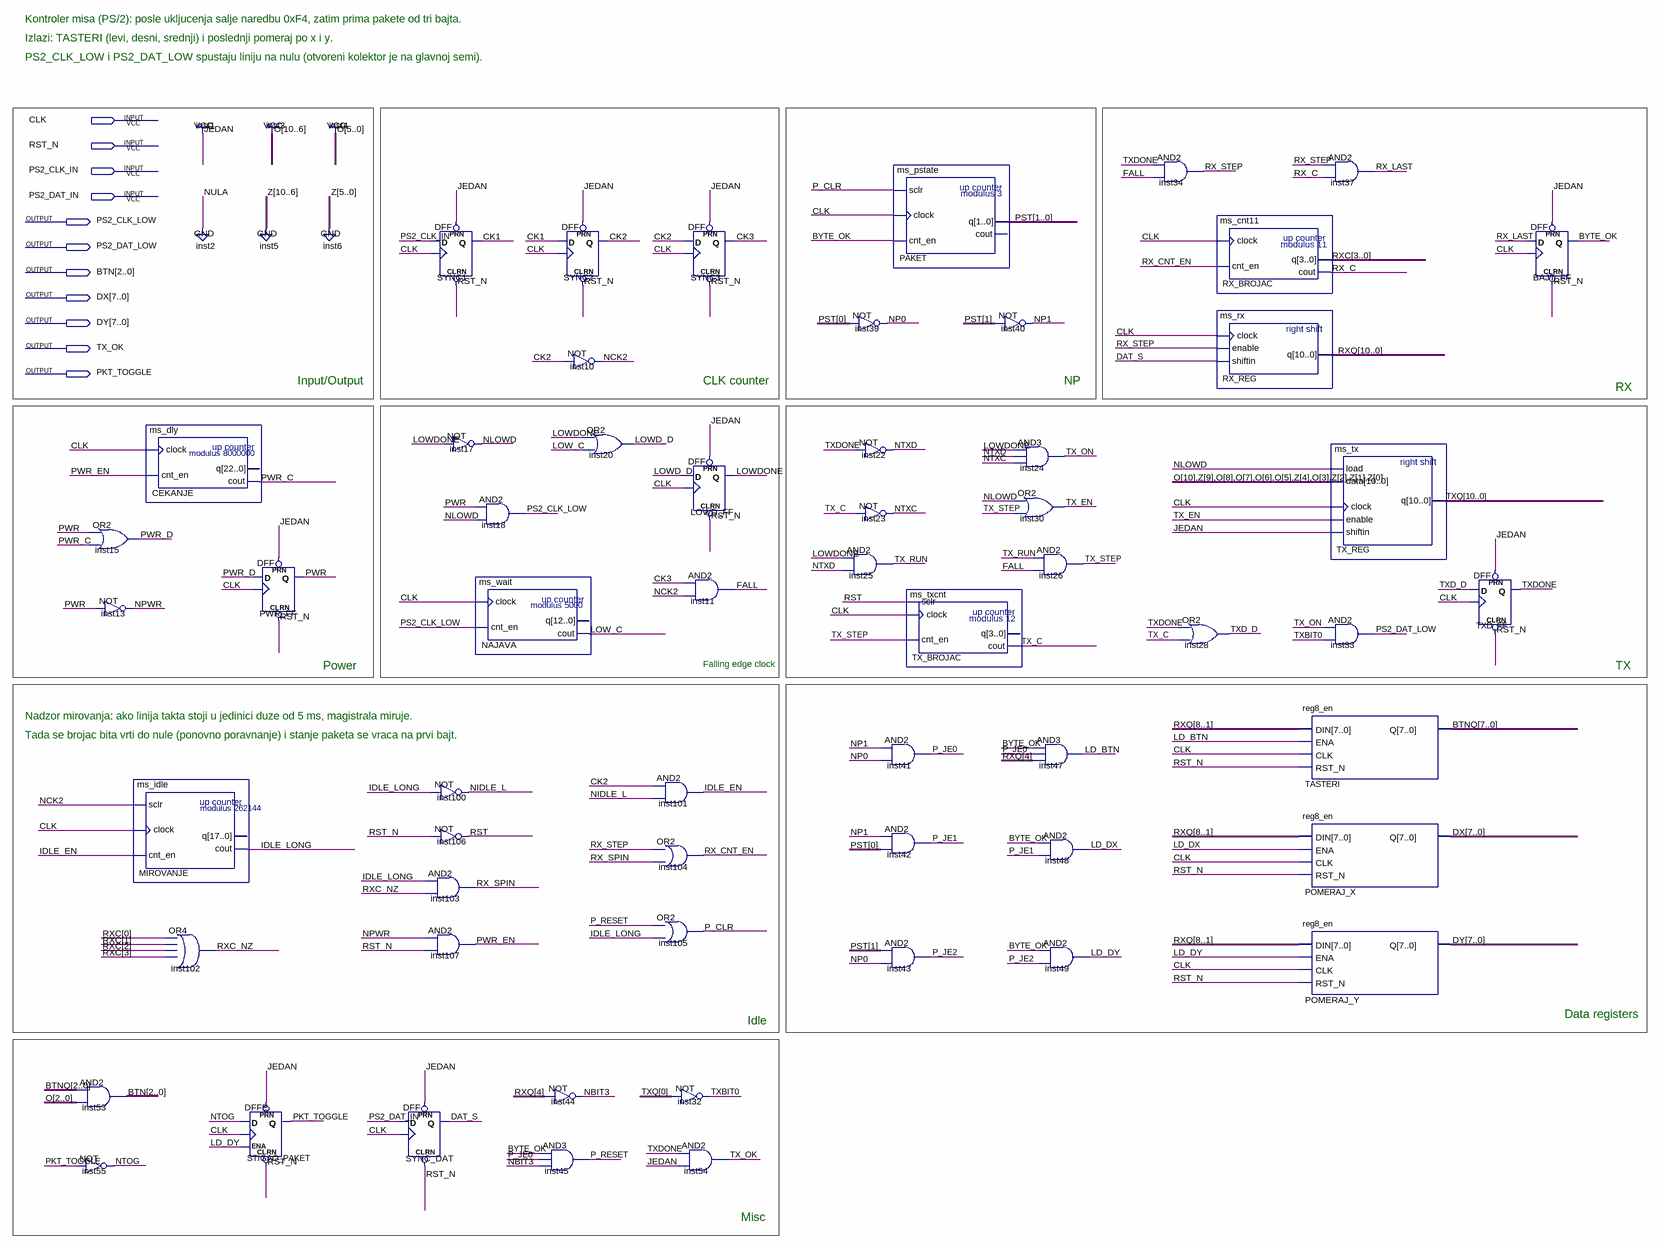
[diagram p0: schematic sheet]
// Quartus schematic mouse_ps2.bdf as structural Verilog: 59 symbols, 11 pins
module mouse_ps2 (
  input  CLK,
  input  RST_N,
  input  PS2_CLK_IN,
  input  PS2_DAT_IN,
  output PS2_CLK_LOW,
  output PS2_DAT_LOW,
  output [2:0] BTN,
  output [7:0] DX,
  output [7:0] DY,
  output TX_OK,
  output PKT_TOGGLE
);

  wire BYTE_OK, CK1, CK2, CK3, DAT_S, FALL, IDLE_EN, IDLE_LONG, LD_BTN, LD_DX, LD_DY, LOW_C, LOWD_D, LOWDONE,
       NBIT3, NCK2, NIDLE_L, NLOWD, NP0, NP1, NPWR, NTOG, NTXC, NTXD, P_CLR, P_JE0, P_JE1, P_JE2, P_RESET,
       PWR, PWR_C, PWR_D, PWR_EN, RST, RX_C, RX_CNT_EN, RX_LAST, RX_SPIN, RX_STEP, RXC_NZ, TX_C, TX_EN,
       TX_ON, TX_RUN, TX_STEP, TXBIT0, TXD_D, TXDONE;
  wire [1:0] PST;
  wire [3:0] RXC;
  wire [7:0] BTNQ;
  wire [10:0] RXQ, TXQ;

  or inst15 (PWR_D, PWR, PWR_C);
  not inst13 (NPWR, PWR);
  assign BTN = BTNQ[2:0] & 3'b111;  // AND2 inst53, 3 bits wide
  not inst55 (NTOG, PKT_TOGGLE);
  ms_dly CEKANJE (.clock(CLK), .cnt_en(PWR_EN), .cout(PWR_C));  // open: q
  ms_idle MIROVANJE (.sclr(NCK2), .clock(CLK), .cnt_en(IDLE_EN), .cout(IDLE_LONG));  // open: q
  or inst102 (RXC_NZ, RXC[0], RXC[1], RXC[2], RXC[3]);
  DFF PWR_FF (.CLRN(RST_N), .CLK(CLK), .D(PWR_D), .PRN(1'b1), .Q(PWR));
  DFFE STIGAO_PAKET (.PRN(1'b1), .CLRN(RST_N), .D(NTOG), .CLK(CLK), .ENA(LD_DY), .Q(PKT_TOGGLE));
  and inst103 (RX_SPIN, IDLE_LONG, RXC_NZ);
  and inst107 (PWR_EN, NPWR, RST_N);
  DFF SYNC_DAT (.CLRN(RST_N), .CLK(CLK), .D(PS2_DAT_IN), .PRN(1'b1), .Q(DAT_S));
  DFF SYNC1 (.CLRN(RST_N), .CLK(CLK), .D(PS2_CLK_IN), .PRN(1'b1), .Q(CK1));
  not inst17 (NLOWD, LOWDONE);
  and inst18 (PS2_CLK_LOW, PWR, NLOWD);
  ms_wait NAJAVA (.clock(CLK), .cnt_en(PS2_CLK_LOW), .cout(LOW_C));  // open: q
  not inst100 (NIDLE_L, IDLE_LONG);
  not inst106 (RST, RST_N);
  DFF SYNC2 (.CLRN(RST_N), .CLK(CLK), .D(CK1), .PRN(1'b1), .Q(CK2));
  not inst10 (NCK2, CK2);
  not inst44 (NBIT3, RXQ[4]);
  and inst45 (P_RESET, BYTE_OK, P_JE0, NBIT3);
  or inst20 (LOWD_D, LOWDONE, LOW_C);
  and inst101 (IDLE_EN, CK2, NIDLE_L);
  or inst104 (RX_CNT_EN, RX_STEP, RX_SPIN);
  or inst105 (P_CLR, P_RESET, IDLE_LONG);
  not inst32 (TXBIT0, TXQ[0]);
  and inst54 (TX_OK, TXDONE, 1'b1);
  DFF SYNC3 (.CLRN(RST_N), .CLK(CLK), .D(CK2), .PRN(1'b1), .Q(CK3));
  DFF LOWD_FF (.CLRN(RST_N), .CLK(CLK), .D(LOWD_D), .PRN(1'b1), .Q(LOWDONE));
  and inst11 (FALL, CK3, NCK2);
  not inst39 (NP0, PST[0]);
  not inst22 (NTXD, TXDONE);
  not inst23 (NTXC, TX_C);
  and inst25 (TX_RUN, LOWDONE, NTXD);
  and inst41 (P_JE0, NP1, NP0);
  and inst42 (P_JE1, NP1, PST[0]);
  and inst43 (P_JE2, PST[1], NP0);
  ms_pstate PAKET (.sclr(P_CLR), .clock(CLK), .cnt_en(BYTE_OK), .q(PST));  // open: cout
  ms_txcnt TX_BROJAC (.sclr(RST), .clock(CLK), .cnt_en(TX_STEP), .cout(TX_C));  // open: q
  not inst40 (NP1, PST[1]);
  and inst24 (TX_ON, LOWDONE, NTXD, NTXC);
  or inst30 (TX_EN, NLOWD, TX_STEP);
  and inst26 (TX_STEP, TX_RUN, FALL);
  and inst47 (LD_BTN, BYTE_OK, P_JE0, RXQ[4]);
  and inst48 (LD_DX, BYTE_OK, P_JE1);
  and inst49 (LD_DY, BYTE_OK, P_JE2);
  and inst34 (RX_STEP, TXDONE, FALL);
  or inst28 (TXD_D, TXDONE, TX_C);
  ms_cnt11 RX_BROJAC (.clock(CLK), .cnt_en(RX_CNT_EN), .cout(RX_C), .q(RXC));
  ms_rx RX_REG (.clock(CLK), .enable(RX_STEP), .shiftin(DAT_S), .q(RXQ));
  and inst37 (RX_LAST, RX_STEP, RX_C);
  ms_tx TX_REG (.load(NLOWD), .data(11'b10111101000), .clock(CLK), .enable(TX_EN), .shiftin(1'b1), .q(TXQ));
  and inst33 (PS2_DAT_LOW, TX_ON, TXBIT0);
  reg8_en TASTERI (.DIN(RXQ[8:1]), .ENA(LD_BTN), .CLK(CLK), .RST_N(RST_N), .Q(BTNQ));
  reg8_en POMERAJ_X (.DIN(RXQ[8:1]), .ENA(LD_DX), .CLK(CLK), .RST_N(RST_N), .Q(DX));
  reg8_en POMERAJ_Y (.DIN(RXQ[8:1]), .ENA(LD_DY), .CLK(CLK), .RST_N(RST_N), .Q(DY));
  DFF TXD_FF (.CLRN(RST_N), .CLK(CLK), .D(TXD_D), .PRN(1'b1), .Q(TXDONE));
  DFF BAJT_FF (.CLRN(RST_N), .CLK(CLK), .D(RX_LAST), .PRN(1'b1), .Q(BYTE_OK));

  // Notes on the sheet:
  //   Kontroler misa (PS/2): posle ukljucenja salje naredbu 0xF4, zatim prima pakete od tri bajta.
  //   Izlazi: TASTERI (levi, desni, srednji) i poslednji pomeraj po x i y.
  //   PS2_CLK_LOW i PS2_DAT_LOW spustaju liniju na nulu (otvoreni kolektor je na glavnoj semi).
  //   Input/Output
  //   CLK counter
  //   NP
  //   RX
  //   Power
  //   Falling edge clock
  //   TX
  //   Nadzor mirovanja: ako linija takta stoji u jedinici duze od 5 ms, magistrala miruje.
  //   Tada se brojac bita vrti do nule (ponovno poravnanje) i stanje paketa se vraca na prvi bajt.
  //   Data registers
  //   Idle
  //   Misc
endmodule
